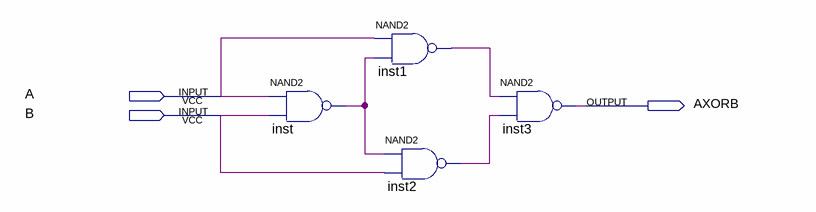
[diagram p0: schematic sheet]
// Quartus schematic AXORB.bdf as structural Verilog: 4 symbols, 3 pins
module AXORB (
  input  A,
  input  B,
  output AXORB
);

  wire inst1_out, inst2_out, inst_out;

  nand inst (inst_out, A, B);
  nand inst1 (inst1_out, A, inst_out);
  nand inst2 (inst2_out, inst_out, B);
  nand inst3 (AXORB, inst1_out, inst2_out);
endmodule
